# Altium schematic sheet GD_Tcontroller_MCU.SchDoc
size A4
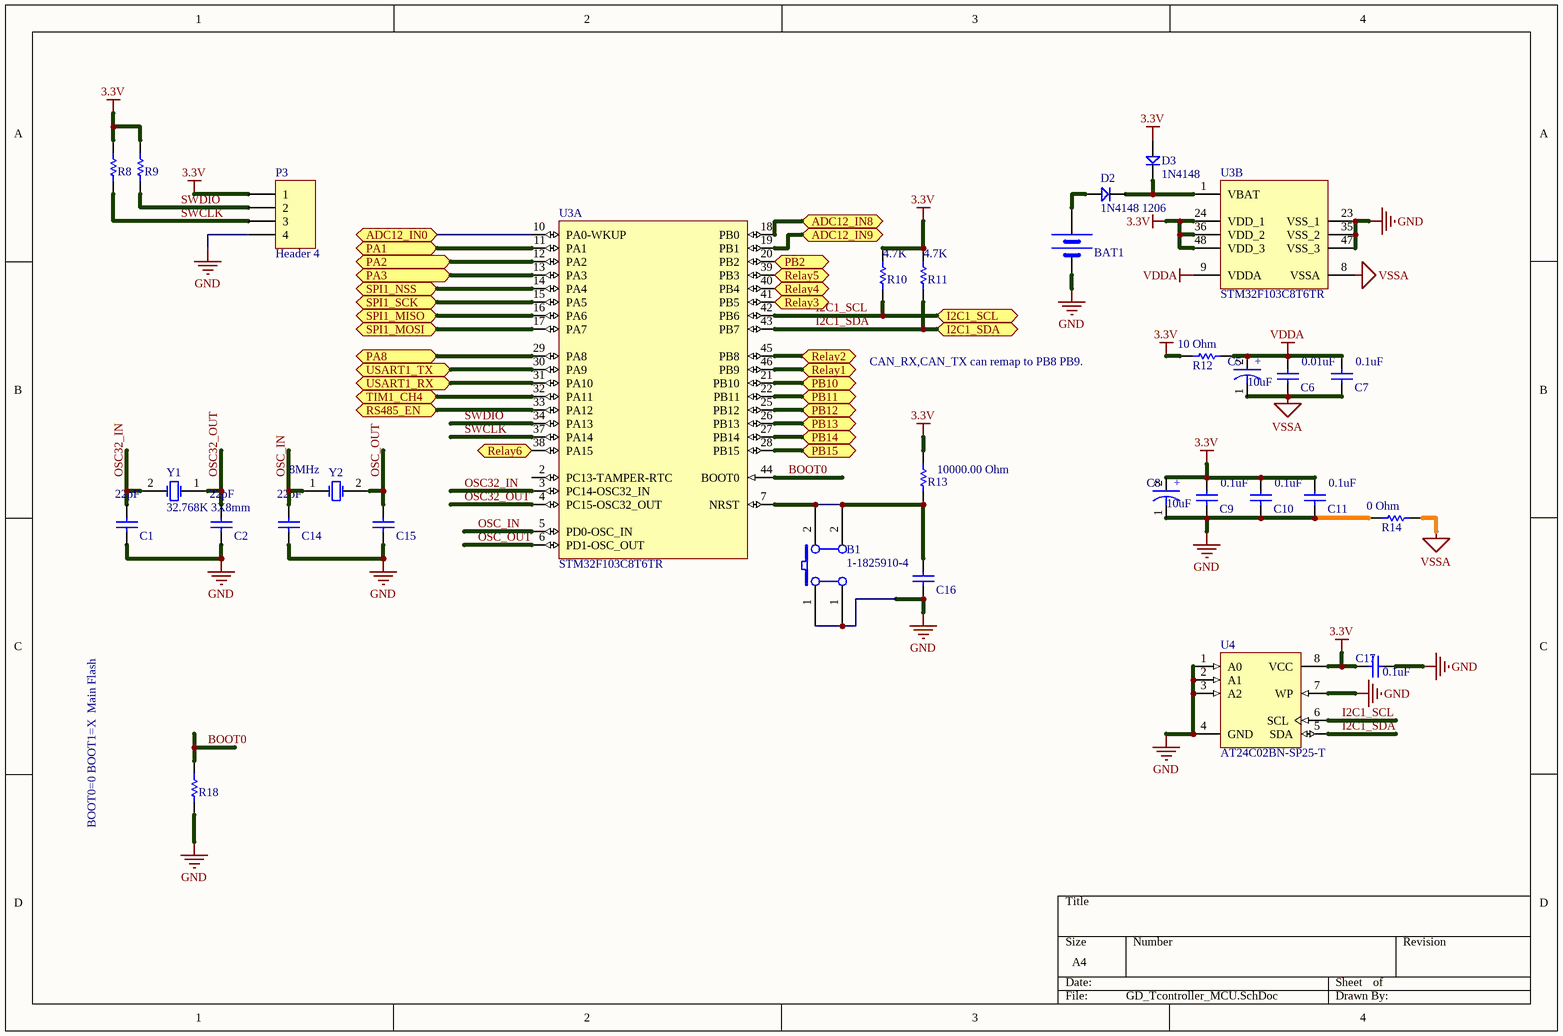
[diagram p0: GD_Tcontroller_MCU.SchDoc]

## Parts
B1  value 1-1825910-4  [AN6_3P6_5]  (hidden comment: SW PUSHBUTTON)
BAT1  CR1220 Sockect SMD  [BATM]  (value not drawn)
C1  value 22pF  [C0805]  (hidden comment: CAP 22pF 50V 0805(2012))
C2  value 22pF  [C0805]  (hidden comment: CAP 22pF 50V 0805(2012))
C5  value 10uF  [TAN3216]  (hidden comment: CAPACITOR)
C6  value 0.01uF  [C0805]  (hidden comment: CAP 0.01uF 50V 0805(2012))
C7  value 0.1uF  [C0805]  (hidden comment: CAP 0.1uF 50V 0805(2012))
C8  value 10uF  [TAN3216]  (hidden comment: CAPACITOR)
C9  value 0.1uF  [C0805]  (hidden comment: CAP 0.1uF 50V 0805(2012))
C10  value 0.1uF  [C0805]  (hidden comment: CAP 0.1uF 50V 0805(2012))
C11  value 0.1uF  [C0805]  (hidden comment: CAP 0.1uF 50V 0805(2012))
C14  value 22pF  [C0805]  (hidden comment: CAP 22pF 50V 0805(2012))
C15  CAP 22pF 50V 0805(2012)  [C0805]  (value not drawn)
C16  CAP 0.1uF 50V 0805(2012)  [C0805]  (value not drawn)
C17  value 0.1uF  [C0805]  (hidden comment: CAP 0.1uF 50V 0805(2012))
D2  1N4148 1206  [DIODE_SOP]
D3  1N4148  [DIODE_SOP]
P3  Header 4  [HDR1X4]
R8  10K 5% 0805(2012)  [R0805]  (value not drawn)
R9  10K 5% 0805(2012)  [R0805]  (value not drawn)
R10  value 4.7K  [R0805]  (hidden comment: 4.7K 5% 0805(2012))
R11  value 4.7K  [R0805]  (hidden comment: 4.7K 5% 0805(2012))
R12  value 10 Ohm  [R0805]  (hidden comment: 10Ohm 5% 0805(2012))
R13  value 10000.00 Ohm  [R0805]  (hidden comment: 10K 5% 0805(2012))
R14  value 0 Ohm  [R0805]  (hidden comment: 0 Ohm 5% 0805(2012))
R18  10K 5% 0805(2012)  [R0805]  (value not drawn)
U3  STM32F103C8T6TR  [STM-LQFP48_L]  (parts A,B of 2)
U4  AT24C02BN-SP25-T  [8S1_L]
Y1  32.768K 3X8mm  [XTAL32]
Y2  8MHz  [XTAL_US]

## Ports
ADC12_IN0, ADC12_IN8, ADC12_IN9, I2C1_SCL, I2C1_SDA, PA1, PA2, PA3, PA8, PB2, PB10, PB11, PB12, PB13, PB14, PB15, Relay1, Relay2, Relay3, Relay4, Relay5, Relay6, RS485_EN, SPI1_MISO, SPI1_MOSI, SPI1_NSS, SPI1_SCK, TIM1_CH4, USART1_RX, USART1_TX

## Nets
3.3V: C8.2 C9.2 C10.2 C11.2 C17.2 D3.1 P3.1 R8.1 R9.1 R10.1 R11.1 R12.1 R13.1 U3.24(VDD_1) U3.36(VDD_2) U3.48(VDD_3) U4.8(VCC)
GND: B1.1(A0) BAT1.2(GND) C1.1 C2.1 C8.1 C9.1 C10.1 C11.1 C14.1 C15.1 C16.1 C17.1 P3.4 R14.1 R18.2 U3.23(VSS_1) U3.35(VSS_2) U3.47(VSS_3) U4.1(A0) U4.2(A1) U4.3(A2) U4.4(GND) U4.7(WP)
VDDA: C5.2 C6.2 C7.2 R12.2 U3.9(VDDA)
VSSA: C5.1 C6.1 C7.1 R14.2 U3.8(VSSA)
ADC12_IN0: U3.10(PA0-WKUP) ; port ADC12_IN0
ADC12_IN8: U3.18(PB0) ; port ADC12_IN8
ADC12_IN9: U3.19(PB1) ; port ADC12_IN9
BOOT0: R18.1 U3.44(BOOT0)
I2C1_SCL: R10.2 U3.42(PB6) U4.6(SCL) ; port I2C1_SCL
I2C1_SDA: R11.2 U3.43(PB7) U4.5(SDA) ; port I2C1_SDA
OSC32_IN: C1.2 U3.3(PC14-OSC32_IN) Y1.2(OSC2)
OSC32_OUT: C2.2 U3.4(PC15-OSC32_OUT) Y1.1(OSC1)
OSC_IN: C14.2 U3.5(PD0-OSC_IN) Y2.1(OSC1)
OSC_OUT: C15.2 U3.6(PD1-OSC_OUT) Y2.2(OSC2)
PA1: U3.11(PA1) ; port PA1
PA2: U3.12(PA2) ; port PA2
PA3: U3.13(PA3) ; port PA3
PA8: U3.29(PA8) ; port PA8
PB2: U3.20(PB2) ; port PB2
PB10: U3.21(PB10) ; port PB10
PB11: U3.22(PB11) ; port PB11
PB12: U3.25(PB12) ; port PB12
PB13: U3.26(PB13) ; port PB13
PB14: U3.27(PB14) ; port PB14
PB15: U3.28(PB15) ; port PB15
Relay1: U3.46(PB9) ; port Relay1
Relay2: U3.45(PB8) ; port Relay2
Relay3: U3.41(PB5) ; port Relay3
Relay4: U3.40(PB4) ; port Relay4
Relay5: U3.39(PB3) ; port Relay5
Relay6: U3.38(PA15) ; port Relay6
RS485_EN: U3.33(PA12) ; port RS485_EN
SPI1_MISO: U3.16(PA6) ; port SPI1_MISO
SPI1_MOSI: U3.17(PA7) ; port SPI1_MOSI
SPI1_NSS: U3.14(PA4) ; port SPI1_NSS
SPI1_SCK: U3.15(PA5) ; port SPI1_SCK
SWCLK: P3.3 R8.2 U3.37(PA14)
SWDIO: P3.2 R9.2 U3.34(PA13)
TIM1_CH4: U3.32(PA11) ; port TIM1_CH4
USART1_RX: U3.31(PA10) ; port USART1_RX
USART1_TX: U3.30(PA9) ; port USART1_TX
NetB1_2: B1.2(B0) C16.2 R13.2 U3.7(NRST)
NetBAT1_1: BAT1.1(VCC) D2.1
NetD2_2: D2.2 D3.2 U3.1(VBAT)

Not connected (* = marked no-connect by the designer): U3 2(PC13-TAMPER-RTC)

## Notes on the sheet
- CAN_RX,CAN_TX can remap to PB8 PB9.
- BOOT0=0 BOOT1=X  Main Flash
- (in symbol EC00035) +

## Library data of the parts
B1 = ES00003: Button ON/OFF，6.3X6.3X9.5MM,DIP-2; Manufacturer: Tyco Electronics; ID: 3; HelpURL: \\192.168.1.3\Esh\Department\RD\CAD\Component\button\ENG_CD_1825910_C6[1].pdf; P/N: ES00003; Manufacturer P/N: 1-1825910-4; Type: *****
BAT1 = BAT
C1 C2 C14 C15 = CMP-1036-01234-1: CAP 22pF 50V ±1% 0805 (2012 Metric) Thickness 0.75mm SMD; Case-EIA: 0805; Case-Metric: 2012; Rated Voltage: 50 V; Tolerance: ±1%; Technology: SMT; Max Thickness: 0.75 mm
  C15: Value: 22pF
C5 C8 = EC00035: TAN 10uF 20% 10V 3216; Manufacturer: AVX; Manufacturer P/N: TAJE106K050RNJ; ID: 35; Type: ****; HelpURL: \\192.168.1.3\Esh\Department\RD\CAD\Component\Capacitor\smd\AVX_tps.PDF; P/N: EC00035
C6 C7 C9-C11 C16 C17 = CMP-1036-00070-1: CAP 0.1uF 50V ±20% 0805 (2012 Metric) Thickness 1mm SMD; Case-Metric: 2012; Case-EIA: 0805; Tolerance: 20%; Rated Voltage: 50 V; Technology: SMT; Max Thickness: 1 mm
  C16: Value: 0.1uF
D2 = D: 1N4148
D3 = D
P3 = Header 4: Header, 4-Pin; LatestRevisionDate: 17-Jul-2002; LatestRevisionNote: Re-released for DXP Platform.; Publisher: Altium Limited
R8 R9 R18 = CMP-1013-00098-1: 10K 0.125W 5% 0805 (2012 Metric)  SMD; Case-EIA: 0805; Case-Metric: 2012; Value: 10000.00 Ohm; Power: 0.125 W; Technology: SMT; Tolerance: 5 %
R10 R11 = CMP-1013-00098-1: 4.7K 0.125W 5% 0805 (2012 Metric)  SMD; Case-EIA: 0805; Case-Metric: 2012; Power: 0.125 W; Technology: SMT; Tolerance: 5 %
R12 R14 = CMP-1013-00098-1: 10Ohm 0.125W 5% 0805 (2012 Metric)  SMD; Case-EIA: 0805; Case-Metric: 2012; Power: 0.125 W; Technology: SMT; Tolerance: 5 %
R13 = CMP-1013-00098-1: 10K 0.125W 5% 0805 (2012 Metric)  SMD; Case-EIA: 0805; Case-Metric: 2012; Power: 0.125 W; Technology: SMT; Tolerance: 5 %
U3 = CMP-0237-00216-3: ARM Cortex-M3 32-bit MCU, 64 KB Flash, 20 KB Internal RAM, 37 I/Os, 48-pin LQFP, -40 to 85 degC, Tape and Reel; A/D Converter: 2x12-bit (10 Channel); Internal RAM Size (kB): 20; Supply Voltage(Vcc) min (V): 2; I/Os (High Current): 37; FLASH Size (Prog) (kB): 64; Operating Frequency(F) (Processor speed) (MHz): 72; Packing: Tape and Reel; PackageReference: LQFP48; ComponentLink2Description: Datasheet; Core: ARM Cortex-M3; ComponentLink3URL: http://www.st.com/st-web-ui/static/active/en/resource/technical/document/datasheet/DM00058181.pdf; ComponentLink1Description: Manufacturer URL; ComponentLink3Description: Package Specification; PartNumber: STM32F103C8T6TR; PackageVersion: Rev. 6, 06/2013; ComponentLink2URL: http://www.st.com/st-web-ui/static/active/en/resource/technical/document/datasheet/CD00161566.pdf; PackageDescription: 48-Pin Low Profile Quad Flat Package, 7 x 7 mm Body, 0.5 mm Pitch; Mounting Technology: Surface Mount; DatasheetVersion: Rev. 16; ComponentLink1URL: http://www.st.com/web/en/home.html
U4 = CMP-0152-00023-1: 2Kbit (256 x 8), 2-wire Bus Automotive Serial EEPROM with full memory Write Protect, 2.5V, 8-Pin SOIC, Tape & Reel; PackageDescription: 8-Lead (0.150" Wide Body), Plastic Gull Wing Small Outline (JEDEC SOIC); Code_IPC: SOIC127P600-8; PackageReference: 8S1; DatasheetVersion: 8517C,  Jan-2009; Code_JEDEC: MS-012-AA; PackageVersion: revC, Mar-2005
Y1 = XTAL_1: 32.768K 3mmX8mm; Published: 8-Jun-2000; LatestRevisionDate: 17-Jul-2002; LatestRevisionNote: Re-released for DXP Platform.; Publisher: Altium Limited
Y2 = XTAL: Crystal Oscillator; Published: 8-Jun-2000; LatestRevisionDate: 17-Jul-2002; LatestRevisionNote: Re-released for DXP Platform.; Publisher: Altium Limited